# EAGLE design gen2down6basic (EAGLE 9.0.1)
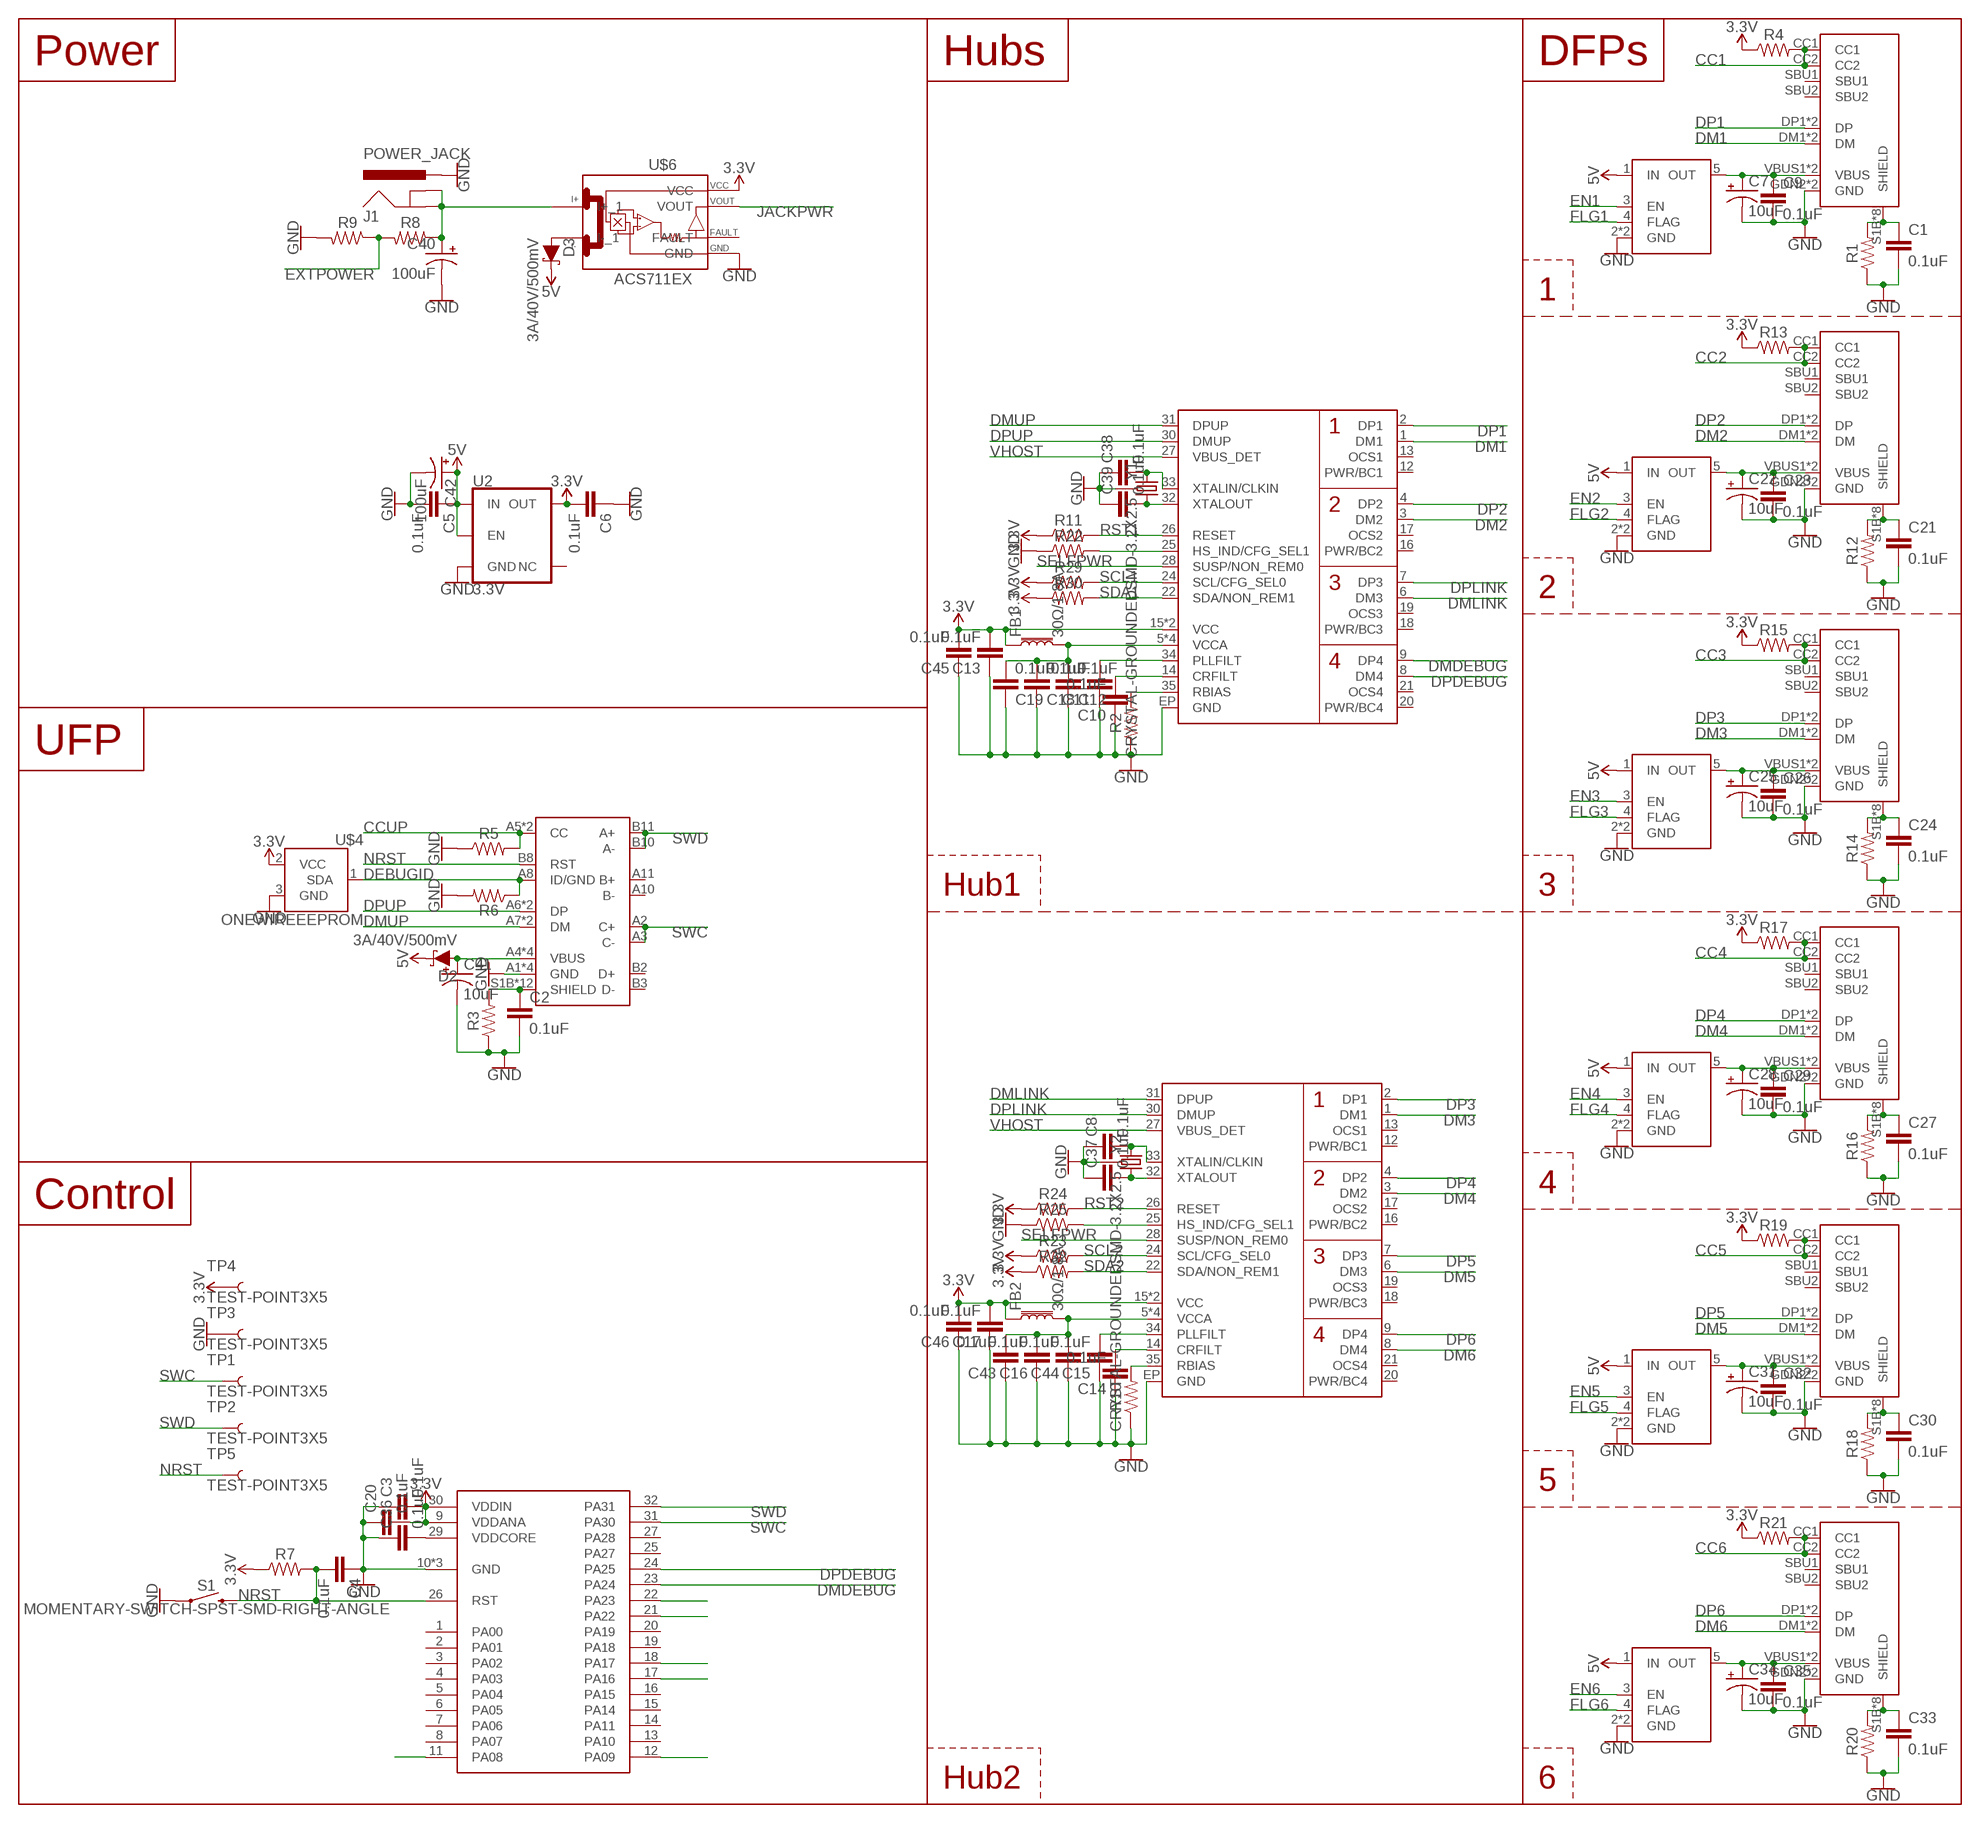
[diagram p0: schematic, sheet 1]

## Parts
C1  0.1uF  0.1UF-0603-25V-(+80/-20%)  [0603]
C2  0.1uF  0.1UF-0603-25V-(+80/-20%)  [0603]
C3  0.1uF  0.1UF-0603-25V-(+80/-20%)  [0603]
C4  0.1uF  0.1UF-0603-25V-(+80/-20%)  [0603]
C5  0.1uF  0.1UF-0603-25V-(+80/-20%)  [0603]
C6  0.1uF  0.1UF-0603-25V-(+80/-20%)  [0603]
C7  10uF  10UF-POLAR-RADIAL-2.5MM-25V-20%  [CPOL-RADIAL-2.5MM-5MM]
C8  0.1uF  0.1UF-0603-25V-(+80/-20%)  [0603]
C9  0.1uF  0.1UF-0603-25V-(+80/-20%)  [0603]
C10  0.1uF  0.1UF-0603-25V-(+80/-20%)  [0603]
C11  0.1uF  0.1UF-0603-25V-(+80/-20%)  [0603]
C12  0.1uF  0.1UF-0603-25V-(+80/-20%)  [0603]
C13  0.1uF  0.1UF-0603-25V-(+80/-20%)  [0603]
C14  0.1uF  0.1UF-0603-25V-(+80/-20%)  [0603]
C15  0.1uF  0.1UF-0603-25V-(+80/-20%)  [0603]
C16  0.1uF  0.1UF-0603-25V-(+80/-20%)  [0603]
C17  0.1uF  0.1UF-0603-25V-(+80/-20%)  [0603]
C18  0.1uF  0.1UF-0603-25V-(+80/-20%)  [0603]
C19  0.1uF  0.1UF-0603-25V-(+80/-20%)  [0603]
C20  0.1uF  0.1UF-0603-25V-(+80/-20%)  [0603]
C21  0.1uF  0.1UF-0603-25V-(+80/-20%)  [0603]
C22  10uF  10UF-POLAR-RADIAL-2.5MM-25V-20%  [CPOL-RADIAL-2.5MM-5MM]
C23  0.1uF  0.1UF-0603-25V-(+80/-20%)  [0603]
C24  0.1uF  0.1UF-0603-25V-(+80/-20%)  [0603]
C25  10uF  10UF-POLAR-RADIAL-2.5MM-25V-20%  [CPOL-RADIAL-2.5MM-5MM]
C26  0.1uF  0.1UF-0603-25V-(+80/-20%)  [0603]
C27  0.1uF  0.1UF-0603-25V-(+80/-20%)  [0603]
C28  10uF  10UF-POLAR-RADIAL-2.5MM-25V-20%  [CPOL-RADIAL-2.5MM-5MM]
C29  0.1uF  0.1UF-0603-25V-(+80/-20%)  [0603]
C30  0.1uF  0.1UF-0603-25V-(+80/-20%)  [0603]
C31  10uF  10UF-POLAR-RADIAL-2.5MM-25V-20%  [CPOL-RADIAL-2.5MM-5MM]
C32  0.1uF  0.1UF-0603-25V-(+80/-20%)  [0603]
C33  0.1uF  0.1UF-0603-25V-(+80/-20%)  [0603]
C34  10uF  10UF-POLAR-RADIAL-2.5MM-25V-20%  [CPOL-RADIAL-2.5MM-5MM]
C35  0.1uF  0.1UF-0603-25V-(+80/-20%)  [0603]
C36  0.1uF  0.1UF-0603-25V-(+80/-20%)  [0603]
C37  0.1uF  0.1UF-0603-25V-(+80/-20%)  [0603]
C38  0.1uF  0.1UF-0603-25V-(+80/-20%)  [0603]
C39  0.1uF  0.1UF-0603-25V-(+80/-20%)  [0603]
C40  100uF  100UF-POLAR-RADIAL-2.5MM-25V-20%  [CPOL-RADIAL-2.5MM-6.5MM]
C41  10uF  10UF-POLAR-RADIAL-2.5MM-25V-20%  [CPOL-RADIAL-2.5MM-5MM]
C42  100uF  100UF-POLAR-RADIAL-2.5MM-25V-20%  [CPOL-RADIAL-2.5MM-6.5MM]
C43  0.1uF  0.1UF-0603-25V-(+80/-20%)  [0603]
C44  0.1uF  0.1UF-0603-25V-(+80/-20%)  [0603]
C45  0.1uF  0.1UF-0603-25V-(+80/-20%)  [0603]
C46  0.1uF  0.1UF-0603-25V-(+80/-20%)  [0603]
D2  3A/40V/500mV  DIODE-SCHOTTKY-B340A  [SMA-DIODE]
D3  3A/40V/500mV  DIODE-SCHOTTKY-B340A  [SMA-DIODE]
FB1  30Ω/1.8A  FERRITE_BEAD-0603  [0603]
FB2  30Ω/1.8A  FERRITE_BEAD-0603  [0603]
J1  POWER_JACK  [POWER_JACK_PTH]
R1  RESISTOR0603  [0603]
R2  RESISTOR0603  [0603]
R3  RESISTOR0603  [0603]
R4  RESISTOR0603  [0603]
R5  RESISTOR0603  [0603]
R6  RESISTOR0603  [0603]
R7  RESISTOR0603  [0603]
R8  RESISTOR0603  [0603]
R9  RESISTOR0603  [0603]
R10  RESISTOR0603  [0603]
R11  RESISTOR0603  [0603]
R12  RESISTOR0603  [0603]
R13  RESISTOR0603  [0603]
R14  RESISTOR0603  [0603]
R15  RESISTOR0603  [0603]
R16  RESISTOR0603  [0603]
R17  RESISTOR0603  [0603]
R18  RESISTOR0603  [0603]
R19  RESISTOR0603  [0603]
R20  RESISTOR0603  [0603]
R21  RESISTOR0603  [0603]
R22  RESISTOR0603  [0603]
R23  RESISTOR0603  [0603]
R24  RESISTOR0603  [0603]
R25  RESISTOR0603  [0603]
R29  RESISTOR0603  [0603]
R30  RESISTOR0603  [0603]
R32  RESISTOR0603  [0603]
S1  MOMENTARY-SWITCH-SPST-SMD-RIGHT-ANGLE  [TACTILE_SWITCH_SMD_RIGHT_ANGLE]
TP1  TEST-POINT3X5  [PAD.03X.05]
TP2  TEST-POINT3X5  [PAD.03X.05]
TP3  TEST-POINT3X5  [PAD.03X.05]
TP4  TEST-POINT3X5  [PAD.03X.05]
TP5  TEST-POINT3X5  [PAD.03X.05]
U2  3.3V  V_REG_AP2112K-3.3V  [SOT23-5]
U$1  AP22804/14*SN  [UDFN2020-6-EP]
U$2  USB-C_DEBUG-HORZ-F  [USB-C_24PIN_HORZ-F-UNTESTED]
U$3  USB-C_USB2ONLY-HORZ-F_12P  [USB-C_12PIN_HORZ-F]
U$4  ONEWIREEEPROM  [SOT23-3]
U$5  USB2512/3/4  [QFN36_6X6]
U$6  ACS711EX  [QFN12_3X3-CURRENT]
U$7  USB2512/3/4  [QFN36_6X6]
U$8  ATSAMD2E1A-M  [QFN32_5X5]
U$10  USB-C_USB2ONLY-HORZ-F_12P  [USB-C_12PIN_HORZ-F]
U$11  AP22804/14*SN  [UDFN2020-6-EP]
U$12  USB-C_USB2ONLY-HORZ-F_12P  [USB-C_12PIN_HORZ-F]
U$13  AP22804/14*SN  [UDFN2020-6-EP]
U$14  USB-C_USB2ONLY-HORZ-F_12P  [USB-C_12PIN_HORZ-F]
U$15  AP22804/14*SN  [UDFN2020-6-EP]
U$16  USB-C_USB2ONLY-HORZ-F_12P  [USB-C_12PIN_HORZ-F]
U$17  AP22804/14*SN  [UDFN2020-6-EP]
U$18  USB-C_USB2ONLY-HORZ-F_12P  [USB-C_12PIN_HORZ-F]
U$19  AP22804/14*SN  [UDFN2020-6-EP]
Y1  CRYSTAL-GROUNDEDSMD-3.2X2.5  [CRYSTAL-SMD-3.2X2.5MM]
Y2  CRYSTAL-GROUNDEDSMD-3.2X2.5  [CRYSTAL-SMD-3.2X2.5MM]

## Nets
3.3V: C3.2 C6.2 C13.2 C17.2 C20.2 C45.2 C46.2 FB1.1 FB2.1 R4.1 R7.1 R11.1 R13.1 R15.1 R17.1 R19.1 R21.1 R23.1 R24.1 R29.1 R30.1 R32.1 TP4.P$1 U2.5(OUT) U$4.2(VCC) U$5.15(VCC) U$5.23(VCC) U$6.P$10(VCC) U$7.15(VCC) U$7.23(VCC) U$8.9(VDDANA) U$8.30(VDDIN)
5V: C5.1 C42.1(+) D2.C D3.C U2.1(IN) U2.3(EN) U$1.1(IN) U$11.1(IN) U$13.1(IN) U$15.1(IN) U$17.1(IN) U$19.1(IN)
BIAS1: R2.2 U$5.35(RBIAS)
BIAS2: R10.2 U$7.35(RBIAS)
CC1: R4.2 U$3.CC1 U$3.CC2
CC2: R13.2 U$10.CC1 U$10.CC2
CC3: R15.2 U$12.CC1 U$12.CC2
CC4: R17.2 U$14.CC1 U$14.CC2
CC5: R19.2 U$16.CC1 U$16.CC2
CC6: R21.2 U$18.CC1 U$18.CC2
CCUP: R5.2 U$2.A5(CC) U$2.B5(CC)
CR1: C10.2 U$5.14(CRFILT)
CR2: C14.2 U$7.14(CRFILT)
DEBUGID: R6.1 U$2.A8(ID/GND) U$4.1(SDA)
DM1: U$3.DM1(DM) U$3.DM2(DM) U$5.1(DM1)
DM2: U$5.3(DM2) U$10.DM1(DM) U$10.DM2(DM)
DM3: U$7.1(DM1) U$12.DM1(DM) U$12.DM2(DM)
DM4: U$7.3(DM2) U$14.DM1(DM) U$14.DM2(DM)
DM5: U$7.6(DM3) U$16.DM1(DM) U$16.DM2(DM)
DM6: U$7.8(DM4) U$18.DM1(DM) U$18.DM2(DM)
DMDEBUG: U$5.9(DP4) U$8.23(PA24)
DMLINK: U$5.6(DM3) U$7.31(DPUP)
DMUP: U$2.A7(DM) U$2.B7(DM) U$5.31(DPUP)
DP1: U$3.DP1(DP) U$3.DP2(DP) U$5.2(DP1)
DP2: U$5.4(DP2) U$10.DP1(DP) U$10.DP2(DP)
DP3: U$7.2(DP1) U$12.DP1(DP) U$12.DP2(DP)
DP4: U$7.4(DP2) U$14.DP1(DP) U$14.DP2(DP)
DP5: U$7.7(DP3) U$16.DP1(DP) U$16.DP2(DP)
DP6: U$7.9(DP4) U$18.DP1(DP) U$18.DP2(DP)
DPDEBUG: U$5.8(DM4) U$8.24(PA25)
DPLINK: U$5.7(DP3) U$7.30(DMUP)
DPUP: U$2.A6(DP) U$2.B6(DP) U$5.30(DMUP)
EN1: U$1.3(EN)
EN2: U$11.3(EN)
EN3: U$13.3(EN)
EN4: U$15.3(EN)
EN5: U$17.3(EN)
EN6: U$19.3(EN)
EXTPOWER: R8.2 R9.1
FLG1: U$1.4(FLAG)
FLG2: U$11.4(FLAG)
FLG3: U$13.4(FLAG)
FLG4: U$15.4(FLAG)
FLG5: U$17.4(FLAG)
FLG6: U$19.4(FLAG)
GND: C1.2 C2.2 C3.1 C4.1 C5.2 C6.1 C7.2(-) C8.1 C9.2 C10.1 C11.1 C12.1 C13.1 C14.1 C15.1 C16.1 C17.1 C18.1 C19.1 C20.1 C21.2 C22.2(-) C23.2 C24.2 C25.2(-) C26.2 C27.2 C28.2(-) C29.2 C30.2 C31.2(-) C32.2 C33.2 C34.2(-) C35.2 C36.1 C37.1 C38.1 C39.1 C40.2(-) C41.2(-) C42.2(-) C43.1 C44.1 C45.1 C46.1 J1.PWR R1.1 R2.1 R3.1 R5.1 R6.2 R9.2 R10.1 R12.1 R14.1 R16.1 R18.1 R20.1 R22.1 R25.1 S1.1 TP3.P$1 U2.2(GND) U$1.2(GND) U$1.EP(GND) U$2.A1(GND) U$2.A12(GND) U$2.B1(GND) U$2.B12(GND) U$3.GDN2(GND) U$3.GND1(GND) U$4.3(GND) U$5.EP(GND) U$6.P$3(GND) U$7.EP(GND) U$8.10(GND) U$8.28(GND) U$8.GND U$10.GDN2(GND) U$10.GND1(GND) U$11.2(GND) U$11.EP(GND) U$12.GDN2(GND) U$12.GND1(GND) U$13.2(GND) U$13.EP(GND) U$14.GDN2(GND) U$14.GND1(GND) U$15.2(GND) U$15.EP(GND) U$16.GDN2(GND) U$16.GND1(GND) U$17.2(GND) U$17.EP(GND) U$18.GDN2(GND) U$18.GND1(GND) U$19.2(GND) U$19.EP(GND) Y1.2 Y1.4 Y2.2 Y2.4
JACKPWR: U$6.P$9(VOUT)
N$4: D3.A U$6.P$2(I-_1)
N$7: C36.2 U$8.29(VDDCORE)
N$11: R22.2 U$5.25(HS_IND/CFG_SEL1)
N$12: R25.2 U$7.25(HS_IND/CFG_SEL1)
N$23: U$8.11(PA08)
N$24: U$8.12(PA09)
N$25: U$8.17(PA16)
N$26: U$8.18(PA17)
N$27: U$8.21(PA22)
N$32: U$8.22(PA23)
NRST: C4.2 R7.2 S1.2 TP5.P$1 U$2.B8(RST) U$8.26(RST)
PLL1: C11.2 U$5.34(PLLFILT)
PLL2: C15.2 U$7.34(PLLFILT)
RST1: R11.2 U$5.26(RESET)
RST2: R24.2 U$7.26(RESET)
SCL1: R29.2 U$5.24(SCL/CFG_SEL0)
SCL2: R23.2 U$7.24(SCL/CFG_SEL0)
SDA1: R30.2 U$5.22(SDA/NON_REM1)
SDA2: R32.2 U$7.22(SDA/NON_REM1)
SELFPWR: U$5.28(SUSP/NON_REM0) U$7.28(SUSP/NON_REM0)
SHIELD1: C1.1 R1.2 U$3.S1B(SHIELD) U$3.S1T(SHIELD) U$3.S2B(SHIELD) U$3.S2T(SHIELD) U$3.S3B(SHIELD) U$3.S3T(SHIELD) U$3.S4B(SHIELD) U$3.S4T(SHIELD)
SHIELD2: C21.1 R12.2 U$10.S1B(SHIELD) U$10.S1T(SHIELD) U$10.S2B(SHIELD) U$10.S2T(SHIELD) U$10.S3B(SHIELD) U$10.S3T(SHIELD) U$10.S4B(SHIELD) U$10.S4T(SHIELD)
SHIELD3: C24.1 R14.2 U$12.S1B(SHIELD) U$12.S1T(SHIELD) U$12.S2B(SHIELD) U$12.S2T(SHIELD) U$12.S3B(SHIELD) U$12.S3T(SHIELD) U$12.S4B(SHIELD) U$12.S4T(SHIELD)
SHIELD4: C27.1 R16.2 U$14.S1B(SHIELD) U$14.S1T(SHIELD) U$14.S2B(SHIELD) U$14.S2T(SHIELD) U$14.S3B(SHIELD) U$14.S3T(SHIELD) U$14.S4B(SHIELD) U$14.S4T(SHIELD)
SHIELD5: C30.1 R18.2 U$16.S1B(SHIELD) U$16.S1T(SHIELD) U$16.S2B(SHIELD) U$16.S2T(SHIELD) U$16.S3B(SHIELD) U$16.S3T(SHIELD) U$16.S4B(SHIELD) U$16.S4T(SHIELD)
SHIELD6: C33.1 R20.2 U$18.S1B(SHIELD) U$18.S1T(SHIELD) U$18.S2B(SHIELD) U$18.S2T(SHIELD) U$18.S3B(SHIELD) U$18.S3T(SHIELD) U$18.S4B(SHIELD) U$18.S4T(SHIELD)
SHIELDUP: C2.1 R3.2 U$2.S1B(SHIELD) U$2.S1T(SHIELD) U$2.S2B(SHIELD) U$2.S2T(SHIELD) U$2.S3B(SHIELD) U$2.S3T(SHIELD) U$2.S4B(SHIELD) U$2.S4T(SHIELD) U$2.S5B(SHIELD) U$2.S5T(SHIELD) U$2.S6B(SHIELD) U$2.S6T(SHIELD)
SWC: TP1.P$1 U$2.A2(C+) U$2.A3(C-) U$8.31(PA30)
SWD: TP2.P$1 U$2.B10(A-) U$2.B11(A+) U$8.32(PA31)
VCCA1: C12.2 C18.2 C19.2 FB1.2 U$5.5(VCCA) U$5.10(VCCA) U$5.29(VCCA) U$5.36(VCCA)
VCCA2: C16.2 C43.2 C44.2 FB2.2 U$7.5(VCCA) U$7.10(VCCA) U$7.29(VCCA) U$7.36(VCCA)
VHOST: C41.1(+) D2.A U$2.A4(VBUS) U$2.A9(VBUS) U$2.B4(VBUS) U$2.B9(VBUS) U$5.27(VBUS_DET) U$7.27(VBUS_DET)
VIN: C40.1(+) J1.GND J1.GNDBREAK R8.1 U$6.P$1(I+_1)
VOUT1: C7.1(+) C9.1 U$1.5(OUT) U$3.VBUS1(VBUS) U$3.VBUS2(VBUS)
VOUT2: C22.1(+) C23.1 U$10.VBUS1(VBUS) U$10.VBUS2(VBUS) U$11.5(OUT)
VOUT3: C25.1(+) C26.1 U$12.VBUS1(VBUS) U$12.VBUS2(VBUS) U$13.5(OUT)
VOUT4: C28.1(+) C29.1 U$14.VBUS1(VBUS) U$14.VBUS2(VBUS) U$15.5(OUT)
VOUT5: C31.1(+) C32.1 U$16.VBUS1(VBUS) U$16.VBUS2(VBUS) U$17.5(OUT)
VOUT6: C34.1(+) C35.1 U$18.VBUS1(VBUS) U$18.VBUS2(VBUS) U$19.5(OUT)
XIN1: C38.2 U$5.33(XTALIN/CLKIN) Y1.1
XIN2: C8.2 U$7.33(XTALIN/CLKIN) Y2.1
XOUT1: C39.2 U$5.32(XTALOUT) Y1.3
XOUT2: C37.2 U$7.32(XTALOUT) Y2.3
Unconnected: U2.4(NC) U$2.A10(B-) U$2.A11(B+) U$2.B2(D+) U$2.B3(D-) U$3.SBU1 U$3.SBU2 U$5.12(PWR/BC1) U$5.13(OCS1) U$5.16(PWR/BC2) U$5.17(OCS2) U$5.18(PWR/BC3) U$5.19(OCS3) U$5.20(PWR/BC4) U$5.21(OCS4) U$6.P$4(FAULT) U$7.12(PWR/BC1) U$7.13(OCS1) U$7.16(PWR/BC2) U$7.17(OCS2) U$7.18(PWR/BC3) U$7.19(OCS3) U$7.20(PWR/BC4) U$7.21(OCS4) U$8.1(PA00) U$8.2(PA01) U$8.3(PA02) U$8.4(PA03) U$8.5(PA04) U$8.6(PA05) U$8.7(PA06) U$8.8(PA07) U$8.13(PA10) U$8.14(PA11) U$8.15(PA14) U$8.16(PA15) U$8.19(PA18) U$8.20(PA19) U$8.25(PA27) U$8.27(PA28) U$10.SBU1 U$10.SBU2 U$12.SBU1 U$12.SBU2 U$14.SBU1 U$14.SBU2 U$16.SBU1 U$16.SBU2 U$18.SBU1 U$18.SBU2

## Notes on the sheet
- Power | Hubs | DFPs
- 1
- 2
- UFP
- Hub1 | 3
- 4
- Control
- 5
- Hub2 | 6

## Library data of the parts
C1-C6 C8-C21 C23 C24 C26 C27 C29 C30 C32 C33 C35-C39 C43-C46 = SparkFun-Capacitors:0.1UF: 0.1µF ceramic capacitors A capacitor is a passive two-terminal electrical component used to store electrical energy temporarily in an electric field.; PROD_ID: CAP-00810
C7 C22 C25 C28 C31 C34 C41 = SparkFun-Capacitors:10UF-POLAR: 10.0µF polarized capacitors A capacitor is a passive two-terminal electrical component used to store electrical energy temporarily in an electric field.; PROD_ID: CAP-08440
C40 C42 = SparkFun-Capacitors:100UF-POLAR: 100µF polarized capacitors A capacitor is a passive two-terminal electrical component used to store electrical energy temporarily in an electric field.; PROD_ID: CAP-08439
D2 D3 = SparkFun-DiscreteSemi:DIODE-SCHOTTKY: Schottky diode A Schottky diode is a semiconductor diode which has a low forward voltage drop and a very fast switching action.; PROD_ID: DIO-09886
FB1 FB2 = SparkFun-Coils:FERRITE_BEAD: Ferrite Bead (blocks, cores, rings, chokes, etc.) Inductor with layers of ferrite used to suppress high frequencies. Often used to isolate high frequency noise. SparkFun Products: IOIO-OTG - V2.2 <https://www.sparkfun.com/products/13613> SparkFun SAMD21 Mini Breakout <https://www.sparkfun.com/products/13664> SparkFun 6 Degrees of Freedom Breakout - LSM6DS3 <https://www.sparkfun.com/products/13339> SparkFun SAMD21 Dev Breakout <https://www.sparkfun.com/products/13672>; PROD_ID: NDUC-07859
J1 = SparkFun-Connectors:POWER_JACK: Power Jack Connector This is the standard 5.5mm barrel jack for power. The PTH is the most common, proven, reliable, footprint. The Slot footprint only works if the mill layer is transmitted to the PCB fab house so be warned. Here are the connectors we sell at SparkFun: DC Barrel Power Jack/Connector <https://www.sparkfun.com/products/119> (PRT-00119) DC Barrel Power Jack/Connector (SMD) <https://www.sparkfun.com/products/12748> (PRT-12748) DC Barrel Jack Adapter - Breadboard Compatible <https://www.sparkfun.com/products/10811> (PRT-10811) It is used on this SparkFun product (and many, many others): SparkFun RedBoard - Programmed with Arduino <https://www.sparkfun.com/products/12757> (DEV-12757) Also, if you need a mating power supply or connector, please check these out: Wall Adapter Power Supply - 9VDC 650mA <https://www.sparkfun.com/products/298> (TOL-00298) DC Barrel Jack Adapter - Male <https://www.sparkfun.com/products/10287> (PRT-10287); PROD_ID: CONN-08197
R1-R25 R29 R30 R32 = SparkFun-Resistors:RESISTOR: Generic Resistor Package
S1 = SparkFun-Switches:MOMENTARY-SWITCH-SPST: Momentary Switch (Pushbutton) - SPST Normally-open (NO) SPST momentary switches (buttons, pushbuttons). Variants PTH-12MM - 12mm square, through-hole Momentary Pushbutton Switch - 12mm Square <https://www.sparkfun.com/products/9190> (COM-09190) PTH-6.0MM, PTH-6.0MM-KIT - 6.0mm square, through-hole Mini Pushbutton Switch <https://www.sparkfun.com/products/97> (COM-00097) KIT package intended for soldering kit's - only one side of pads' copper is exposed. PTH-RIGHT-ANGLE-KIT - Right-angle, through-hole Right Angle Tactile Button <https://www.sparkfun.com/products/10791> - Used on SparkFun BigTime Watch Kit <https://www.sparkfun.com/products/11734> SMD-12MM - 12mm square, surface-mount Tactile Button - SMD (12mm) <https://www.sparkfun.com/products/12993> (COM-12993) Used on SparkFun PicoBoard <https://www.sparkfun.com/products/11888> SMD-4.5MM - 4.5mm Square Trackball Switch Used on SparkFun Blackberry Trackballer Breakout <https://www.sparkfun.com/products/13169> SMD-4.6MMX2.8MM - 4.60mm x 2.80mm, surface mount Used on SparkFun SAMD21 Mini Breakout <https://www.sparkfun.com/products/13664> SMD-5.2MM, SMD-5.2-REDUNDANT - 5.2mm square, surface-mount Mini Pushbutton Switch - SMD <https://www.sparkfun.com/products/8720> (COM-08720) Used on Arduino Pro Mini <https://www.sparkfun.com/products/11114> REDUNDANT package connects both switch circuits together SMD-6.0X3.5MM - 6.0 x 3.5mm, surface mount Momentary Reset Switch SMD <https://www.sparkfun.com/products/8229> (COM-08229) SMD-6.2MM-TALL - 6.2mm square, surface mount Tactile Button - SMD (6mm) <https://www.sparkfun.com/products/12992> Used on SparkFun Digital Sandbox <https://www.sparkfun.com/products/12651> SMD-RIGHT-ANGLE - Right-angle, surface mount Used on SparkFun Block for Intel® Edison - Arduino <https://www.sparkfun.com/products/13036>; PROD_ID: COMP-12265
TP1-TP5 = SparkFun-Connectors:TEST-POINT: SparkFun Test Points Bare copper test points for troubleshooting or In-Circuit-Testing. These are used by our Production team for verifying production board runs using pogo-pins on test beds. SparkFun Products: SparkFun LSM9DS1 Breakout <https://www.sparkfun.com/products/13284> SparkFun PSOC <https://www.sparkfun.com/products/13714> SparkFun Load Cell Amplifier <https://www.sparkfun.com/products/13879>
U2 = SparkFun-IC-Power:V_REG_AP2112: AP2112 - 600mA CMOS LDO Regulator w/ Enable The AP2112 is CMOS process low dropout linear regulator with enable function, the regulator delivers a guaranteed 600mA (min.) continuous load current. Features Output Voltage Accuracy: ±1.5% Output Current: 600mA (Min.) Foldback Short Current Protection: 50mA Enable Function to Turn ON/OFF VOUT Low Dropout Voltage (3.3V): 250mV (Typ.) @IOUT=600mA Excellent Load Regulation: 0.2%/A (Typ.) Excellent Line Regulation: 0.02%/V (Typ.) Low Quiescent Current: 55μA (Typ.) Low Standby Current: 0.01μA (Typ.) Low Output Noise: 50μVRMS PSRR: 100Hz -65dB, 1kHz -65dB OTSD Protection Stable with 1.0μF Flexible Cap: Ceramic, Tantalum and Aluminum Electrolytic Operation Temperature Range: -40°C to 85°C ESD: MM 400V, HBM 4000V; PROD_ID: VREG-12457
U$1 U$11 U$13 U$15 U$17 U$19 = 12voltman:AP22804/14
U$2 = 12voltman:USB-C_DEBUG
U$3 U$10 U$12 U$14 U$16 U$18 = 12voltman:USB-C_USB2ONLY
U$4 = 12voltman:ONEWIREEEPROM
U$5 U$7 = 12voltman:USB2512/3/4
U$6 = 12voltman:ACS711: ACS711 - Analog AC/DC current sensor (UNSUITABLE FOR LINE VOLTAGES) Hall effect linear current sensor with overcurrent fault output. Outputs analog voltage proportional to current range(-Imax to +Imax maps to 0v to VCC). Fault pin latches low when current passes 100% of its rated value, and remains latched until power is reset for at least 100 us. Technical specifications: VCC: 3-5.5V Isolation voltage: 100V 15.5A or 31A sensing range on EX package 12.5A or 25A sensing range on LC package Range centered at Vcc/2
U$8 = 12voltman:ATSAMD2*E1*: ATSAMD2*E - 32bit low-power Cortex M0+ microcontroller This part is for the lowest pin count pieces in the SAMD20 and SAMD21 series of low-power microcontrollers. The SAMD21 series adds USB and DMA to the SAMD20 series. Includes Atmel's configurable serial interfaces (SERCOMs) which can be configured to be a UART, I2C, LIN, or SPI. Available packages include WLCSP (SAMD21 only), TQFP, and QFN. Technical specifications: VCC: 1.62-3.63V Core frequency up to 48MHz Program flash: 32/64/128/256 kb RAM: 4/8/16/32 kb SERCOMS: 4 GPIOs: 26 ADC channels: 10 ADC resolution: 12 bits DACs: 1
Y1 Y2 = SparkFun-Clocks:CRYSTAL-GROUNDED: Crystals w/ Ground Pin (Generic) These are passive quartz crystals, which can be used as a clock source for a microcontroller. Crystal's are usually two-terminal devices. A third terminal may be optionally connected to ground, as recommended by the manufaturer.

## Board
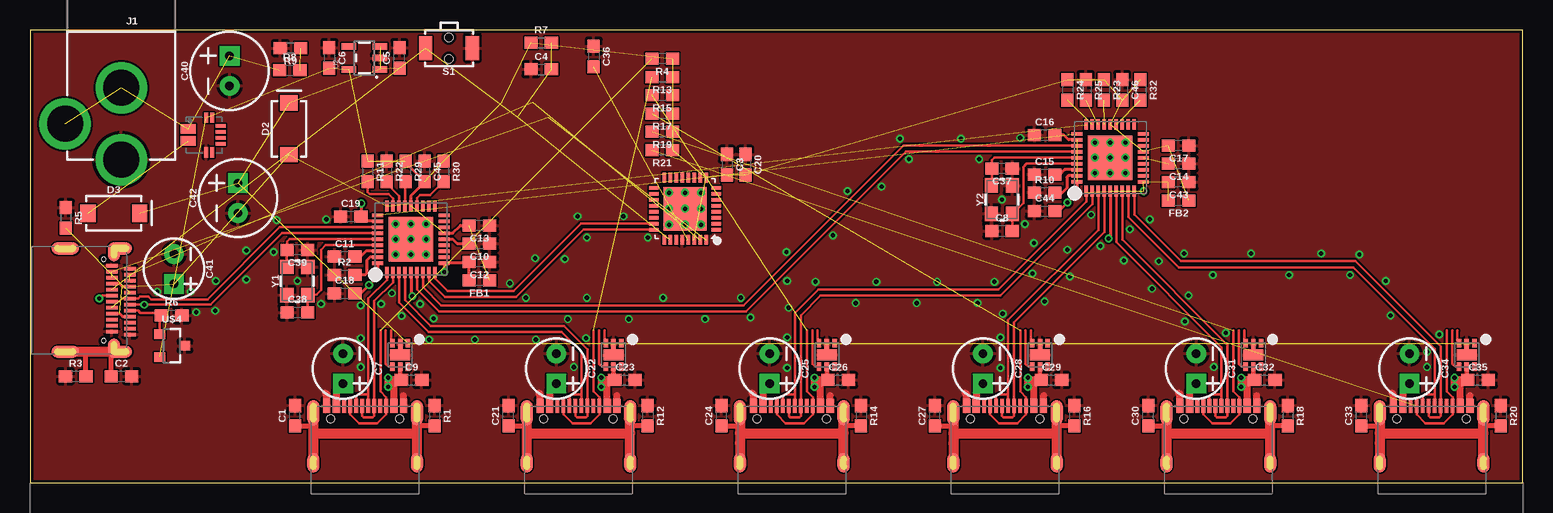
[diagram p1: board, top side]
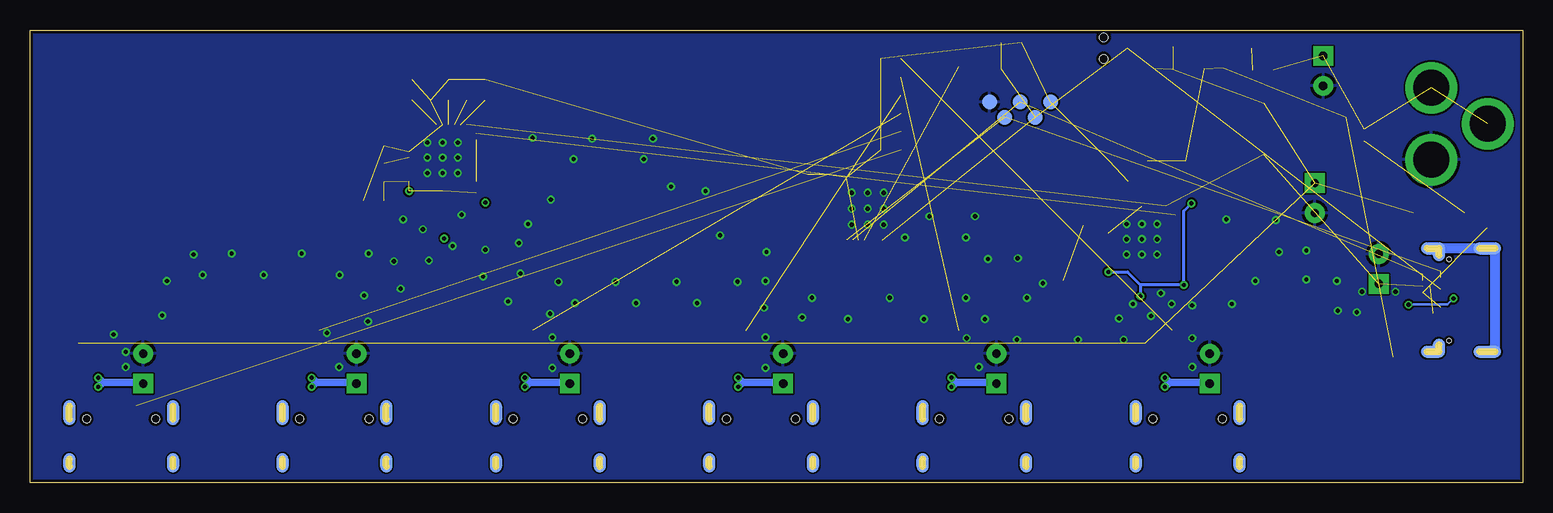
[diagram p2: board, bottom side, seen from below]

Size 124.44 x 37.77 mm. Coordinates in mm from the lower left corner, seen from the top.
Outline: 0,0 124.44,0 124.44,37.77 0,37.77 0,0
Copper layers (1*16): Top 0.035mm / dielectric 1.5mm / Bottom 0.035mm
Design rules "SeeedStudio_2layer_DRU": minimum track width 6mil, minimum drill 12mil, track to track 6mil, track to pad 6mil, pad to pad 6mil, via to via 6mil, smd to smd 0mil, copper to edge 10mil, drill to drill 10mil, minimum pad ring 10mil, minimum via ring 6mil, stop-mask expansion 2mil, vias tented up to drill 100mil, thermal gap 10mil

### Footprints (pad centres in the part's own frame; a part is rotated, then mirrored left to right if it is on the bottom)
0603 = smd 1.1 x 1: 1 -0.85,0; 2 0.85,0
CPOL-RADIAL-2.5MM-5MM = drill 0.7 pad 1.651 square: 1 1.25,0 | drill 0.7 pad 1.651: 2 -1.25,0
CPOL-RADIAL-2.5MM-6.5MM = drill 0.7 pad 1.651 square: 1 1.25,0 | drill 0.7 pad 1.651: 2 -1.25,0
SMA-DIODE = smd 1.27 x 1.47: A -2.15,0; C 2.15,0
POWER_JACK_PTH = drill 2.997 pad 4.318: GND 0,7.7; GNDBREAK 4.7,10.7; PWR 0,13.7
TACTILE_SWITCH_SMD_RIGHT_ANGLE = smd 1.1 x 2: 1 -1.95,0; 2 1.95,0 | hole 0.7: 0,0.9; 0,-0.9
PAD.03X.05 = smd 1.27 x 1.27: P$1 0,0
SOT23-5 = smd 0.55 x 1.2: 1 -0.95,-1.3; 2 0,-1.3; 3 0.95,-1.3; 4 0.95,1.3; 5 -0.95,1.3
UDFN2020-6-EP = smd 0.37 x 0.7: 1 -0.65,-0.975; 3 0.65,-0.975; 4 0.65,0.975; 5 0,0.975; 6 -0.65,0.975 | smd 0.37 x 0.875: 2 0,-0.887 | smd 1.67 x 0.9: EP 0,0
USB-C_24PIN_HORZ-F-UNTESTED = smd 0.28 x 0.95: A1 2.625,-1.975; A2 2.125,-1.975; A3 1.625,-1.975; A4 1.125,-1.975; A5 0.625,-1.975; A6 0.125,-1.975; A7 -0.375,-1.975; A8 -0.875,-1.975; A9 -1.375,-1.975; A10 -1.875,-1.975; A11 -2.375,-1.975; A12 -2.875,-1.975; B1 -2.625,-0.475; B2 -2.125,-0.475; B3 -1.625,-0.475; B4 -1.125,-0.475; B5 -0.625,-0.475; B6 -0.125,-0.475; B7 0.375,-0.475; B8 0.875,-0.475; B9 1.375,-0.475; B10 1.875,-0.475; B11 2.375,-0.475; B12 2.875,-0.475 | smd 1 x 2.3 bottom: S1B -4.32,3.4; S6B 4.32,3.4 | smd 1 x 2.3: S1T -4.32,3.4; S6T 4.32,3.4 | smd 1.6 x 1 bottom: S2B -4.02,-0.65; S5B 4.02,-0.65 | smd 1.6 x 1: S2T -4.02,-0.65; S5T 4.02,-0.65 | smd 1 x 2 bottom: S3B -4.32,-1.15; S4B 4.32,-1.15 | smd 1 x 2: S3T -4.32,-1.15; S4T 4.32,-1.15 | hole 0.35: -3.4,0.2; 3.4,0.2
USB-C_12PIN_HORZ-F = smd 0.3 x 1.15: CC1 1.25,-0.575; CC2 -1.75,-0.575; DM1 -0.25,-0.575; DM2 0.75,-0.575; DP1 0.25,-0.575; DP2 -0.75,-0.575; SBU1 -1.25,-0.575; SBU2 1.75,-0.575 | smd 0.6 x 1.15: GDN2 3.2,-0.575; GND1 -3.2,-0.575; VBUS1 -2.4,-0.575; VBUS2 2.4,-0.575 | smd 1 x 2.1 bottom: S1B -4.32,0; S4B 4.32,0 | smd 1 x 2.1: S1T -4.32,0; S4T 4.32,0 | smd 1 x 1.6 bottom: S2B -4.32,4.18; S3B 4.32,4.18 | smd 1 x 1.6: S2T -4.32,4.18; S3T 4.32,4.18 | hole 0.65: -2.89,0.5; 2.89,0.5
SOT23-3 = smd 0.8 x 0.9: 1 -0.95,-1; 2 0.95,-1; 3 0,1.1
QFN36_6X6 = smd 0.9 x 0.28: 1 -2.775,2; 2 -2.775,1.5; 3 -2.775,1; 4 -2.775,0.5; 5 -2.775,0; 6 -2.775,-0.5; 7 -2.775,-1; 8 -2.775,-1.5; 9 -2.775,-2; 19 2.775,-2; 20 2.775,-1.5; 21 2.775,-1; 22 2.775,-0.5; 23 2.775,0; 24 2.775,0.5; 25 2.775,1; 26 2.775,1.5; 27 2.775,2 | smd 0.28 x 0.9: 10 -2,-2.775; 11 -1.5,-2.775; 12 -1,-2.775; 13 -0.5,-2.775; 14 0,-2.775; 15 0.5,-2.775; 16 1,-2.775; 17 1.5,-2.775; 18 2,-2.775; 28 2,2.775; 29 1.5,2.775; 30 1,2.775; 31 0.5,2.775; 32 0,2.775; 33 -0.5,2.775; 34 -1,2.775; 35 -1.5,2.775; 36 -2,2.775 | smd 3.7 x 3.7: EP 0,0
QFN12_3X3-CURRENT = smd 1.27 x 0.8: P$1 -1.35,0.5; P$2 -1.35,-0.5 | smd 0.3 x 0.85: P$3 0.15,-1.45; P$4 0.65,-1.45; P$9 0.65,1.45; P$10 0.15,1.45 | smd 0.85 x 0.3: P$5 1.35,-0.75; P$6 1.35,-0.25; P$7 1.35,0.25; P$8 1.35,0.75
QFN32_5X5 = smd 0.8 x 0.3: 1 -2.6,1.75; 2 -2.6,1.25; 3 -2.6,0.75; 4 -2.6,0.25; 5 -2.6,-0.25; 6 -2.6,-0.75; 7 -2.6,-1.25; 8 -2.6,-1.75; 17 2.6,-1.75; 18 2.6,-1.25; 19 2.6,-0.75; 20 2.6,-0.25; 21 2.6,0.25; 22 2.6,0.75; 23 2.6,1.25; 24 2.6,1.75 | smd 0.3 x 0.8: 9 -1.75,-2.6; 10 -1.25,-2.6; 11 -0.75,-2.6; 12 -0.25,-2.6; 13 0.25,-2.6; 14 0.75,-2.6; 15 1.25,-2.6; 16 1.75,-2.6; 25 1.75,2.6; 26 1.25,2.6; 27 0.75,2.6; 28 0.25,2.6; 29 -0.25,2.6; 30 -0.75,2.6; 31 -1.25,2.6; 32 -1.75,2.6 | smd 3.6 x 3.6: GND 0,0
CRYSTAL-SMD-3.2X2.5MM = smd 1.2 x 1.1: 1 -1.175,-0.875; 2 1.175,-0.875; 3 1.175,0.875; 4 -1.175,0.875

### Placement (x,y rotation side)
C1  22.1,5.59 90 top
C2  7.62,8.89 0 top
C3  58.1,26.54 270 top
C4  42.61,34.48 0 top
C5  30.8,35.43 90 top
C6  24.96,35.43 270 top
C7  26.1,9.53 270 top
C8  81.03,21.02 0 top
C9  31.81,8.57 0 top
C10  37.47,19.94 180 top
C11  26.23,18.86 0 top
C12  37.47,18.41 180 top
C13  37.47,21.46 180 top
C14  95.76,26.61 180 top
C15  84.58,25.72 0 top
C16  84.58,29.02 0 top
C17  95.76,28.13 180 top
C18  26.23,15.81 0 top
C19  26.73,22.23 0 top
C20  59.63,26.54 270 top
C21  39.88,5.59 90 top
C22  43.88,9.53 270 top
C23  49.59,8.57 0 top
C24  57.66,5.59 90 top
C25  61.66,9.53 270 top
C26  67.37,8.57 0 top
C27  75.44,5.59 90 top
C28  79.44,9.53 270 top
C29  85.15,8.57 0 top
C30  93.22,5.59 90 top
C31  97.22,9.53 270 top
C32  102.93,8.57 0 top
C33  111,5.59 90 top
C34  115,9.53 270 top
C35  120.71,8.57 0 top
C36  46.99,35.56 270 top
C37  81.03,26.23 180 top
C38  22.29,14.22 0 top
C39  22.29,19.43 180 top
C40  16.64,34.35 90 top
C41  12,17.84 270 top
C42  17.34,23.75 90 top
C43  95.76,25.08 180 top
C44  84.58,22.67 0 top
C45  32.89,25.97 270 top
C46  91.06,32.77 270 top
D2  21.59,29.53 90 top
D3  6.99,22.48 0 top
FB1  37.47,16.89 180 top
FB2  95.76,23.56 180 top
J1  7.62,40.64 180 top
R1  33.72,5.59 270 top
R2  26.23,17.34 0 top
R3  3.81,8.89 0 top
R4  52.7,35.37 180 top
R5  2.98,22.1 270 top
R6  11.81,13.97 0 top
R7  42.61,36.7 0 top
R8  21.65,34.42 0 top
R9  21.72,36.26 180 top
R10  84.58,24.19 0 top
R11  28.13,25.97 270 top
R12  51.5,5.59 270 top
R13  52.7,33.85 180 top
R14  69.28,5.59 270 top
R15  52.7,32.32 180 top
R16  87.06,5.59 270 top
R17  52.7,30.8 180 top
R18  104.84,5.59 270 top
R19  52.7,29.27 180 top
R20  122.62,5.59 270 top
R21  52.7,27.75 180 top
R22  29.72,25.97 270 top
R23  89.53,32.77 270 top
R24  86.49,32.77 270 top
R25  88.01,32.77 270 top
R29  31.31,25.97 270 top
R30  34.48,25.97 270 top
R32  92.58,32.77 270 top
S1  34.92,36.26 180 top
TP1  41.91,31.75 0 bottom
TP2  43.18,30.48 0 bottom
TP3  44.45,31.75 0 bottom
TP4  39.37,31.75 0 bottom
TP5  40.64,30.48 0 bottom
U2  27.88,35.43 90 top
U$1  30.86,10.67 180 top
U$2  6.35,15.24 90 top
U$3  27.94,5.84 180 top
U$4  11.81,11.43 270 top
U$5  31.75,20.32 90 top
U$6  14.54,29.02 0 top
U$7  90.04,27.11 90 top
U$8  ATSAMD2E1*A-M  [QFN32_5X5]  54.61,22.86 180 top
U$10  45.72,5.84 180 top
U$11  48.64,10.67 180 top
U$12  63.5,5.84 180 top
U$13  66.42,10.67 180 top
U$14  81.28,5.84 180 top
U$15  84.2,10.67 180 top
U$16  99.06,5.84 180 top
U$17  101.98,10.67 180 top
U$18  116.84,5.84 180 top
U$19  119.76,10.67 180 top
Y1  22.29,16.83 90 top
Y2  81.03,23.62 90 top

### Tracks (layer width: path | path; a pad name or v marks a point on that pad's centre or on a via)
3.3V  (28 unrouted)
  Top 0.254: U$5.15 35.23,20.82 35.88,21.46 C13.2 | U$5.23 31.75,23.94 32.89,25.08 C45.2 31.3,26.71 R29.1
5V  (11 unrouted)
BIAS1
  Top 0.254: U$5.35 28.34,18.82 28.07,18.54 28.07,17.46 27.94,17.34 R2.2
BIAS2
  Top 0.254: U$7.35 86.58,25.61 86.42,25.46 86.42,24.57 86.04,24.19 R10.2
CC1  (1 unrouted)
  Top 0.203: U$3.CC1 26.69,5.7 27.43,4.95 28.96,4.95 29.69,5.69 U$3.CC2 29.69,7.14 29.21,7.62 29.21,12.7
CC2  (1 unrouted)
  Top 0.203: U$10.CC1 44.47,5.7 45.21,4.95 46.74,4.95 47.47,5.69 U$10.CC2 47.47,7.14 46.99,7.62 46.99,12.7
CC3  (1 unrouted)
  Top 0.203: U$12.CC1 62.25,5.7 62.99,4.95 64.52,4.95 65.25,5.69 U$12.CC2 65.25,7.14 64.77,7.62 64.77,12.7
CC4  (1 unrouted)
  Top 0.203: U$14.CC1 80.03,5.7 80.77,4.95 82.3,4.95 83.03,5.69 U$14.CC2 83.03,7.14 82.55,7.62 82.55,12.7
CC5  (1 unrouted)
  Top 0.203: U$16.CC1 97.81,5.7 98.55,4.95 100.08,4.95 100.81,5.69 U$16.CC2 100.81,7.14 100.33,7.62 100.33,12.7
CC6  (1 unrouted)
  Top 0.203: U$18.CC1 115.59,5.7 116.33,4.95 117.86,4.95 118.59,5.69 U$18.CC2 118.59,7.14 118.11,7.62 118.11,12.7
CCUP  (2 unrouted)
CR1
  Top 0.254: U$5.14 35.24,20.32 35.62,19.94 C10.2
CR2  (1 unrouted)
DEBUGID
  Top 0.203: U$4.1 10.81,13.82 R6.1 10.77,14.16 9.21,14.16 9,14.37 U$2.A8
DM1
  Top 0.203: U$3.DM2 27.19,7.19 27.37,7.37 28.19,7.37 | U$3.DM1 28.19,7.37 | U$5.1 29.75,16.92 28.19,15.36 28.19,7.37
DM2
  Top 0.203: U$10.DM2 44.97,7.19 45.15,7.37 45.97,7.37 | U$10.DM1 45.97,7.37 | 45.97,7.37 45.97,10.92 44.32,12.57 33.21,12.57 30.75,15.03 U$5.3
DM3
  Top 0.203: U$12.DM2 62.75,7.19 62.93,7.37 63.75,7.37 | U$12.DM1 63.75,7.37 | 63.75,7.37 63.75,14.16 65.72,16.13 80.71,16.13 88.04,23.46 U$7.1
DM4
  Top 0.203: U$14.DM2 80.53,7.19 80.71,7.37 81.53,7.37 | U$14.DM1 81.53,7.37 | U$7.3 89.04,21.1 81.53,13.59 81.53,7.37
DM5
  Top 0.203: U$16.DM2 98.31,7.19 98.49,7.37 99.31,7.37 | U$16.DM1 99.31,7.37 | 99.31,7.37 99.31,11.31 90.54,20.07 U$7.6
DM6
  Top 0.203: U$18.DM2 116.09,7.19 116.27,7.37 117.09,7.37 | U$18.DM1 117.09,7.37 | 117.09,7.37 117.09,11.18 110.3,17.97 95.76,17.97 91.54,22.19 U$7.8
DMDEBUG
  Top 0.203: U$5.9 33.75,17.05 34.8,16 40.32,16 45.93,21.61 U$8.23
DMLINK
  Top 0.203: U$5.6 32.25,16.14 34.1,14.29 59.69,14.29 73.02,27.61 U$7.31
DMUP  (via drill 0.35)
  Top 0.203: U$2.B7 6.03,15.62 v5.78,15.37 | U$2.A7 v9.52,14.87 v9.53,14.86 15.05,14.86 21.01,20.82 U$5.31
  Bottom 0.203: v5.78,15.37 6.29,14.86 v9.53,14.86
DP1
  Top 0.203: U$3.DP1 27.69,5.58 27.81,5.46 28.57,5.46 28.69,5.58 U$3.DP2 28.69,15.16 30.25,16.72 U$5.2
DP2
  Top 0.203: U$10.DP1 45.47,5.58 45.59,5.46 46.35,5.46 46.47,5.58 U$10.DP2 46.47,11.11 44.5,13.08 33.4,13.08 31.25,15.23 U$5.4
DP3
  Top 0.203: U$12.DP1 63.25,5.58 63.37,5.46 64.14,5.46 64.25,5.58 U$12.DP2 64.25,13.97 65.9,15.62 80.9,15.62 88.54,23.27 U$7.2
DP4
  Top 0.203: U$14.DP1 81.03,5.58 81.15,5.46 81.92,5.46 82.03,5.58 U$14.DP2 82.03,13.39 89.54,20.9 U$7.4
DP5
  Top 0.203: U$16.DP1 98.81,5.58 98.93,5.46 99.69,5.46 99.81,5.58 U$16.DP2 99.81,11.51 91.04,20.27 U$7.7
DP6
  Top 0.203: U$18.DP1 116.59,5.58 116.71,5.46 117.47,5.46 117.59,5.58 U$18.DP2 117.59,11.38 110.49,18.48 95.95,18.48 92.04,22.38 U$7.9
DPDEBUG
  Top 0.203: U$5.8 33.25,16.85 34.61,15.49 40.51,15.49 46.13,21.11 U$8.24
DPLINK
  Top 0.203: U$5.7 32.75,16.34 34.29,14.8 59.5,14.8 72.82,28.11 U$7.30
DPUP
  Top 0.203: U$2.B6 7.43,15.12 7.68,15.37 U$2.A6 9.02,15.37 9.21,15.56 9.84,15.56 10.1,15.3 14.8,15.3 20.81,21.32 U$5.30
EN1
  Top 0.203: 30.1,12.7 30.1,11.87 30.21,11.76 U$1.3
EN2
  Top 0.203: 47.88,12.7 47.88,11.87 47.99,11.76 U$11.3
EN3
  Top 0.203: 65.66,12.7 65.66,11.87 65.77,11.76 U$13.3
EN4
  Top 0.203: 83.44,12.7 83.44,11.87 83.55,11.76 U$15.3
EN5
  Top 0.203: 101.22,12.7 101.22,11.87 101.33,11.76 U$17.3
EN6
  Top 0.203: 119,12.7 119,11.87 119.11,11.76 U$19.3
EXTPOWER  (1 unrouted)
FLG1
  Top 0.203: 29.65,12.7 29.65,9.93 29.89,9.69 U$1.4
FLG2
  Top 0.203: 47.43,12.7 47.43,9.93 47.67,9.69 U$11.4
FLG3
  Top 0.203: 65.22,12.7 65.22,9.93 65.45,9.69 U$13.4
FLG4
  Top 0.203: 83,12.7 83,9.93 83.23,9.69 U$15.4
FLG5
  Top 0.203: 100.78,12.7 100.78,9.93 101.01,9.69 U$17.4
FLG6
  Top 0.203: 118.56,12.7 118.56,9.93 118.79,9.69 U$19.4
GND  (via drill 0.35)
  Top 0.584: U$3.GDN2 24.74,7.39 24.64,7.49 | U$3.GND1 31.14,7.28 | U$10.GDN2 42.52,7.39 42.42,7.49 | U$10.GND1 48.92,7.28 | U$12.GDN2 60.3,7.39 60.2,7.49 | U$12.GND1 66.7,7.28 | U$14.GDN2 78.08,7.39 77.98,7.49 | U$14.GND1 84.48,7.28 | U$16.GDN2 95.86,7.39 95.76,7.49 | U$16.GND1 102.26,7.28 | U$18.GDN2 113.64,7.39 113.54,7.49 | U$18.GND1 120.04,7.28
  other vias: 30.48,19.05 33.02,19.05 33.02,21.59 30.48,21.59 31.75,21.59 31.75,20.32 33.02,20.32 30.48,20.32 31.75,19.05 88.77,27.11 88.77,28.38 90.04,28.38 91.31,28.38 91.31,27.11 91.31,25.84 90.04,25.84 88.77,25.84 90.04,27.11 30.16,15.81 29.27,14.92 27.56,14.8 27.56,12.06 27.56,9.65 32.51,14.92 33.66,13.72 30.99,13.91 46.35,12.06 45.34,9.65 91.69,21.15 94.11,18.48 96.2,19.11 93.34,21.97 110.05,17.34 116.46,9.65 116.46,10.92 113.41,13.97 104.97,17.34 98.62,17.34 96.58,15.62 99.69,12.51 117.47,12.38 113.03,16.83 110.81,19.05 107.63,19.11 101.79,19.11 88.46,22.35 86.49,19.43 83.57,17.46 81.09,14.1 80.9,9.59 80.9,12.13 63.12,9.59 63.12,12.13 63.25,14.61 65.47,16.76 70.55,16.76 75.63,16.76 80.39,16.76 83.69,20 78.99,14.99 73.91,14.99 68.83,14.99 89.22,19.75 86.68,17.21 84.58,15.11 91.19,18.54 93.54,16.19 96.27,13.46 98.68,9.65 55.94,21.53 53.28,21.53 53.28,24.19 55.94,24.19 54.61,21.53 54.61,24.19 55.94,22.86 53.28,22.86 54.61,22.86 22.29,16.83 20.32,19.24 24.7,21.97 20.57,21.91 18.03,19.37 15.49,16.83 13.4,15.94 10.6,15.94 13.84,14.22 15.43,14.35 18.03,16.95 24.26,14.92 33.27,11.94 37.08,11.94 42.16,11.94 81.03,23.62 40.01,16.64 41.34,15.43 46.42,15.43 52.77,15.43 59.25,15.43 63.06,19.24 68.14,24.32 72.52,28.7 77.6,28.7 82.55,28.77 79.12,26.99 73.28,26.99 70.99,24.7 66.93,20.64 63.12,16.83 60.07,13.78 56.26,13.65 49.91,13.65 44.83,13.65 42.1,18.73 45.66,22.23 49.47,22.23 44.58,18.67 46.42,20.45 51.5,20.45 82.93,21.59
  pour Bottom (rank 2): 0,0 0,38.1 124.46,38.1 124.46,0
  pour Top (rank 2): 0,0 0,38.1 124.46,38.1 124.46,0
N$1
  cutout Top: 29.46,22.61 34.04,22.61 34.04,18.03 29.46,18.03
  cutout Top: 87.76,29.4 92.33,29.4 92.33,24.83 87.76,24.83
  cutout Top: 56.77,20.7 52.45,20.7 52.45,25.02 56.77,25.02
N$4  (1 unrouted)
N$7  (1 unrouted)
N$11
  Top 0.203: R22.2 29.72,24.96 30.75,23.92 U$5.25
N$12  (1 unrouted)
NRST  (5 unrouted)
PLL1
  Top 0.203: 27.01,18.44 C11.2
  Top 0.254: U$5.34 28.02,19.32 27.56,18.86 C11.2
PLL2
  Top 0.254: U$7.34 86.25,26.11 85.85,25.72 C15.2
RST1
  Top 0.203: R11.2 28.13,24.26 28.32,24.07 29.91,24.07 30.25,23.73 U$5.26
RST2  (1 unrouted)
SCL1
  Top 0.203: U$5.24 31.25,25.07 R29.2
SCL2  (1 unrouted)
SDA1
  Top 0.203: U$5.22 32.25,23.74 32.51,24 33.36,24 R30.2
SDA2  (1 unrouted)
SELFPWR  (1 unrouted)
SHIELD1  (4 unrouted)
  Top 0.406: 23.62,2.88 23.62,3.3 | R1.2 32.26,4.74 U$3.S1T | C1.1 23.62,4.74 U$3.S4B
  Top 0.813: U$3.S4B 23.62,4.13 | 23.62,4.13 23.62,3.3 U$3.S3B | U$3.S2B 32.26,4.13 | 32.26,4.13 U$3.S1T | 23.62,4.13 32.26,4.13
SHIELD2  (4 unrouted)
  Top 0.406: 41.4,2.88 41.4,3.3 | R12.2 50.04,4.74 U$10.S1T | C21.1 41.4,4.74 U$10.S4B
  Top 0.813: U$10.S4B 41.4,4.13 | 41.4,4.13 41.4,3.3 U$10.S3B | U$10.S2B 50.04,4.13 | 50.04,4.13 U$10.S1T | 41.4,4.13 50.04,4.13
SHIELD3  (4 unrouted)
  Top 0.406: 59.18,2.88 59.18,3.3 | R14.2 67.82,4.74 U$12.S1T | C24.1 59.18,4.74 U$12.S4B
  Top 0.813: U$12.S4B 59.18,4.13 | 59.18,4.13 59.18,3.3 U$12.S3B | U$12.S2B 67.82,4.13 | 67.82,4.13 U$12.S1T | 59.18,4.13 67.82,4.13
SHIELD4  (4 unrouted)
  Top 0.406: 76.96,2.88 76.96,3.3 | R16.2 85.6,4.74 U$14.S1T | C27.1 76.96,4.74 U$14.S4B
  Top 0.813: U$14.S4B 76.96,4.13 | 76.96,4.13 76.96,3.3 U$14.S3B | U$14.S2B 85.6,4.13 | 85.6,4.13 U$14.S1T | 76.96,4.13 85.6,4.13
SHIELD5  (4 unrouted)
  Top 0.406: 94.74,2.88 94.74,3.3 | R18.2 103.38,4.74 U$16.S1T | C30.1 94.74,4.74 U$16.S4B
  Top 0.813: U$16.S4B 94.74,4.13 | 94.74,4.13 94.74,3.3 U$16.S3B | U$16.S2B 103.38,4.13 | 103.38,4.13 U$16.S1T | 94.74,4.13 103.38,4.13
SHIELD6  (4 unrouted)
  Top 0.406: 112.52,2.88 112.52,3.3 | R20.2 121.16,4.74 U$18.S1T | C33.1 112.52,4.74 U$18.S4B
  Top 0.813: U$18.S4B 112.52,4.13 | 112.52,4.13 112.52,3.3 U$18.S3B | U$18.S2B 121.16,4.13 | 121.16,4.13 U$18.S1T | 112.52,4.13 121.16,4.13
SHIELDUP  (8 unrouted)
  Top 0.406: R3.2 4.66,10.92 5.08,10.92 | C2.1 6.77,10.92 6.35,10.92
  Top 0.813: U$2.S3B 6.35,10.92 5.08,10.92 U$2.S1T
  Bottom 0.813: U$2.S4B U$2.S6B 2.29,19.56 2.29,10.92 U$2.S1T
SWC  (3 unrouted)
SWD  (3 unrouted)
VCCA1  (via drill 0.35)
  Top 0.254: U$5.5 31.75,15.68 v31.88,15.56 | U$5.36 28.98,17.23 v28.26,16.51 27.56,15.81 C18.2 | v27.62,23.3 27.62,22.26 C19.2 27.99,21.82 U$5.29 | FB1.2 C12.2 36.52,18.32 U$5.10 34.52,17.61 v34.54,17.59
  Bottom 0.254: v27.62,23.3 28.26,22.67 v28.26,16.51 31.88,16.51 | 31.88,16.51 v31.88,15.56 | v34.54,17.59 32.96,17.59 31.88,16.51
VCCA2  (via drill 0.35)  (6 unrouted)
  Top 0.254: U$7.5 90.04,20.51 v89.92,20.38 | U$7.36 87.27,24.15 v86.49,23.37 85.79,22.67 C44.2 | U$7.29 86.58,28.61 86.17,29.02 C16.2
  other vias: 92.84,24.32
VHOST  (5 unrouted)
  Top 0.254: U$2.B9 7.45,16.61 7.7,16.36 U$2.A4 | U$2.B4 7.47,14.12 7.72,13.87 U$2.A9
VIN  (4 unrouted)
VOUT1  (via drill 0.35)
  Top 0.356: C9.1 30.86,8.68 U$1.5
  Top 0.584: v29.84,8 v29.84,8.76 | v29.84,8.76 30.34,8.27 U$3.VBUS1 | C9.1 30.04,8.57 v29.84,8.76 | 26.21,8.38 C7.1 25.54,7.72 U$3.VBUS2
  Bottom 0.61: 29.46,8.38 v29.84,8 | v29.84,8.76 29.46,8.38 | C7.1 26.21,8.38 29.46,8.38
VOUT2  (via drill 0.35)
  Top 0.356: C23.1 48.64,8.68 U$11.5
  Top 0.584: v47.62,8 v47.62,8.76 | v47.62,8.76 48.12,8.27 U$10.VBUS1 | C23.1 47.82,8.57 v47.62,8.76 | 43.99,8.38 C22.1 43.32,7.72 U$10.VBUS2
  Bottom 0.61: 47.24,8.38 v47.62,8 | v47.62,8.76 47.24,8.38 | C22.1 43.99,8.38 47.24,8.38
VOUT3  (via drill 0.35)
  Top 0.356: C26.1 66.42,8.68 U$13.5
  Top 0.584: v65.41,8 v65.41,8.76 | v65.41,8.76 65.9,8.27 U$12.VBUS1 | C26.1 65.6,8.57 v65.41,8.76 | 61.77,8.38 C25.1 61.1,7.72 U$12.VBUS2
  Bottom 0.61: 65.02,8.38 v65.41,8 | v65.41,8.76 65.02,8.38 | C25.1 61.77,8.38 65.02,8.38
VOUT4  (via drill 0.35)
  Top 0.356: C29.1 84.2,8.68 U$15.5
  Top 0.584: v83.19,8 v83.19,8.76 | v83.19,8.76 83.68,8.27 U$14.VBUS1 | C29.1 83.38,8.57 v83.19,8.76 | 79.55,8.38 C28.1 78.88,7.72 U$14.VBUS2
  Bottom 0.61: 82.8,8.38 v83.19,8 | v83.19,8.76 82.8,8.38 | C28.1 79.55,8.38 82.8,8.38
VOUT5  (via drill 0.35)
  Top 0.356: C32.1 101.98,8.68 U$17.5
  Top 0.584: v100.97,8 v100.97,8.76 | v100.97,8.76 101.46,8.27 U$16.VBUS1 | C32.1 101.16,8.57 v100.97,8.76 | 97.33,8.38 C31.1 96.66,7.72 U$16.VBUS2
  Bottom 0.61: 100.58,8.38 v100.97,8 | v100.97,8.76 100.58,8.38 | C31.1 97.33,8.38 100.58,8.38
VOUT6  (via drill 0.35)
  Top 0.356: C35.1 119.76,8.68 U$19.5
  Top 0.584: v118.75,8 v118.75,8.76 | v118.75,8.76 119.24,8.27 U$18.VBUS1 | C35.1 118.94,8.57 v118.75,8.76 | 115.11,8.38 C34.1 114.44,7.72 U$18.VBUS2
  Bottom 0.61: 118.36,8.38 v118.75,8 | v118.75,8.76 118.36,8.38 | C34.1 115.11,8.38 118.36,8.38
XIN1
  Top 0.203: U$5.33 24.65,19.82 24.26,19.43 24.26,16.07 23.91,15.72 Y1.1 23.16,14.31 C38.2
XIN2
  Top 0.203: U$7.33 83.07,26.61 82.8,26.35 82.8,23.35 Y2.1 81.88,22.42 C8.2
XOUT1
  Top 0.203: 21.44,18.09 Y1.3 21.41,19.47 C39.2 21.44,20.11 21.65,20.32 U$5.32
XOUT2
  Top 0.203: U$7.32 80.39,27.11 80.18,26.9 C37.2 80.18,24.82 Y2.3